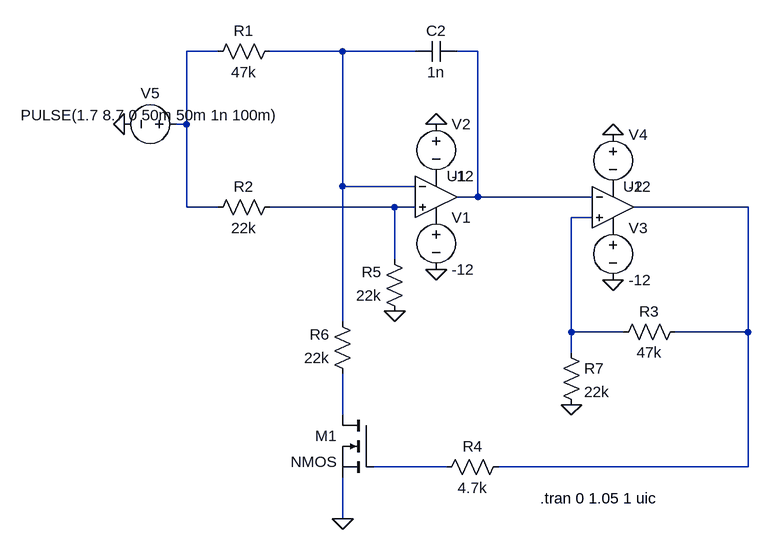
[diagram p0: schematic Square_VCO.asc]
Square_VCO.asc, the LTspice schematic file:
Version 4
SHEET 1 880 696
WIRE -176 -48 -224 -48
WIRE 16 -48 -96 -48
WIRE 128 -48 16 -48
WIRE 224 -48 192 -48
WIRE -224 64 -224 -48
WIRE -224 64 -240 64
WIRE 16 160 16 -48
WIRE 128 160 16 160
WIRE 224 176 224 -48
WIRE 224 176 192 176
WIRE 400 176 224 176
WIRE -224 192 -224 64
WIRE -176 192 -224 192
WIRE 96 192 -96 192
WIRE 128 192 96 192
WIRE 640 192 464 192
WIRE 400 208 368 208
WIRE 96 272 96 192
WIRE 16 368 16 160
WIRE 368 384 368 208
WIRE 448 384 368 384
WIRE 640 384 640 192
WIRE 640 384 528 384
WIRE 368 416 368 384
WIRE 16 512 16 448
WIRE 176 592 64 592
WIRE 640 592 640 384
WIRE 640 592 256 592
WIRE 16 672 16 608
FLAG 160 64 0
FLAG 160 288 0
FLAG 432 304 0
FLAG 432 80 0
FLAG 368 496 0
FLAG 16 672 0
FLAG -320 64 0
FLAG 96 352 0
SYMBOL Opamps\\UniversalOpamp2 160 176 R0
SYMATTR InstName U1
SYMBOL Opamps\\UniversalOpamp2 432 192 R0
SYMATTR InstName U2
SYMBOL voltage 160 192 R0
WINDOW 123 0 0 Left 2
WINDOW 39 0 0 Left 2
SYMATTR InstName V1
SYMATTR Value -12
SYMBOL voltage 160 48 R0
WINDOW 123 0 0 Left 2
WINDOW 39 0 0 Left 2
SYMATTR InstName V2
SYMATTR Value -12
SYMBOL voltage 432 208 R0
WINDOW 123 0 0 Left 2
WINDOW 39 0 0 Left 2
SYMATTR InstName V3
SYMATTR Value -12
SYMBOL voltage 432 64 R0
WINDOW 123 0 0 Left 2
WINDOW 39 0 0 Left 2
SYMATTR InstName V4
SYMATTR Value -12
SYMBOL cap 192 -64 R90
WINDOW 0 0 32 VBottom 2
WINDOW 3 32 32 VTop 2
SYMATTR InstName C2
SYMATTR Value 1n
SYMBOL res -80 -64 R90
WINDOW 0 0 56 VBottom 2
WINDOW 3 32 56 VTop 2
SYMATTR InstName R1
SYMATTR Value 47k
SYMBOL res -80 176 R90
WINDOW 0 0 56 VBottom 2
WINDOW 3 32 56 VTop 2
SYMATTR InstName R2
SYMATTR Value 22k
SYMBOL res 544 368 R90
WINDOW 0 0 56 VBottom 2
WINDOW 3 32 56 VTop 2
SYMATTR InstName R3
SYMATTR Value 47k
SYMBOL res 272 576 R90
WINDOW 0 0 56 VBottom 2
WINDOW 3 32 56 VTop 2
SYMATTR InstName R4
SYMATTR Value 4.7k
SYMBOL res 112 368 R180
WINDOW 0 36 76 Left 2
WINDOW 3 36 40 Left 2
SYMATTR InstName R5
SYMATTR Value 22k
SYMBOL res 32 464 R180
WINDOW 0 36 76 Left 2
WINDOW 3 36 40 Left 2
SYMATTR InstName R6
SYMATTR Value 22k
SYMBOL nmos 64 512 M0
SYMATTR InstName M1
SYMBOL res 352 400 R0
SYMATTR InstName R7
SYMATTR Value 22k
SYMBOL voltage -224 64 R90
WINDOW 0 -32 56 VBottom 2
WINDOW 3 2 56 VBottom 2
WINDOW 123 0 0 Left 2
WINDOW 39 0 0 Left 2
SYMATTR InstName V5
SYMATTR Value PULSE(1.7 8.7 0 50m 50m 1n 100m)
TEXT 320 640 Left 2 !.tran 0 1.05 1 uic

The netlist it stands for:
* Square_VCO.asc
XU1 N004 N002 P001 P002 N003 level.2 Avol=1Meg GBW=10Meg Slew=10Meg ilimit=25m rail=0 Vos=0 phimargin=45 en=0 enk=0 in=0 ink=0 Rin=500Meg  ; pins IN+ IN- V+ V- OUT
XU2 N006 N003 P003 P004 N005 level.2 Avol=1Meg GBW=10Meg Slew=10Meg ilimit=25m rail=0 Vos=0 phimargin=45 en=0 enk=0 in=0 ink=0 Rin=500Meg  ; pins IN+ IN- V+ V- OUT
V1 P002 0 -12
V2 0 P001 -12
V3 P004 0 -12
V4 0 P003 -12
C2 N003 N002 1n
R1 N002 N001 47k
R2 N004 N001 22k
R3 N005 N006 47k
R4 N005 N008 4.7k
R5 0 N004 22k
R6 N007 N002 22k
M1 N007 N008 0 0 NMOS
R7 N006 0 22k
V5 N001 0 PULSE(1.7 8.7 0 50m 50m 1n 100m)
.model NMOS NMOS
.model PMOS PMOS
.lib standard.mos
.tran 0 1.05 1 uic
.lib UniversalOpamps2.sub
.backanno
.end